# EAGLE design sensor (EAGLE 9.6.2)
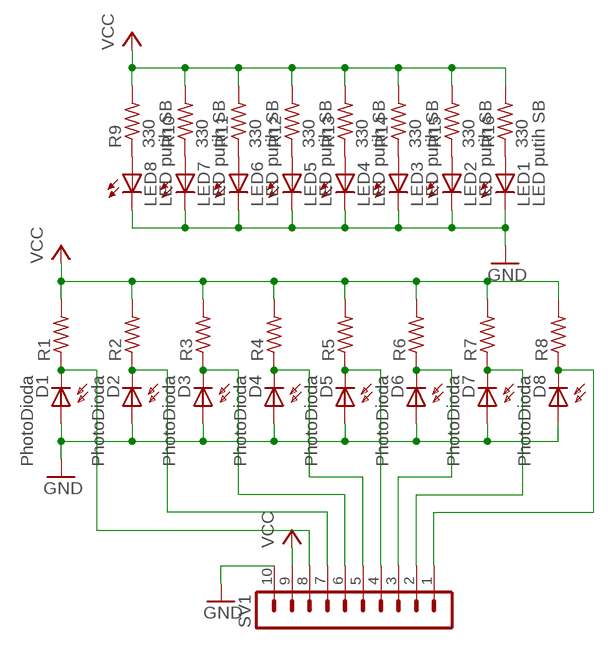
[diagram p0: schematic, sheet 1]

## Parts
D1  PhotoDioda  SFH225  [SFH225]
D2  PhotoDioda  SFH225  [SFH225]
D3  PhotoDioda  SFH225  [SFH225]
D4  PhotoDioda  SFH225  [SFH225]
D5  PhotoDioda  SFH225  [SFH225]
D6  PhotoDioda  SFH225  [SFH225]
D7  PhotoDioda  SFH225  [SFH225]
D8  PhotoDioda  SFH225  [SFH225]
LED1  LED putih SB  LED5MM  [LED5MM]
LED2  LED putih SB  LED5MM  [LED5MM]
LED3  LED putih SB  LED5MM  [LED5MM]
LED4  LED putih SB  LED5MM  [LED5MM]
LED5  LED putih SB  LED5MM  [LED5MM]
LED6  LED putih SB  LED5MM  [LED5MM]
LED7  LED putih SB  LED5MM  [LED5MM]
LED8  LED putih SB  LED5MM  [LED5MM]
R1  R-US_0207/10  [0207/10]
R2  R-US_0207/10  [0207/10]
R3  R-US_0207/10  [0207/10]
R4  R-US_0207/10  [0207/10]
R5  R-US_0207/10  [0207/10]
R6  R-US_0207/10  [0207/10]
R7  R-US_0207/10  [0207/10]
R8  R-US_0207/10  [0207/10]
R9  330  R-US_0207/10  [0207/10]
R10  330  R-US_0207/10  [0207/10]
R11  330  R-US_0207/10  [0207/10]
R12  330  R-US_0207/10  [0207/10]
R13  330  R-US_0207/10  [0207/10]
R14  330  R-US_0207/10  [0207/10]
R15  330  R-US_0207/10  [0207/10]
R16  330  R-US_0207/10  [0207/10]
SV1  MA10-1  [MA10-1]

## Nets
GND: D1.A D2.A D3.A D4.A D5.A D6.A D7.A D8.A LED1.K(C) LED2.K(C) LED3.K(C) LED4.K(C) LED5.K(C) LED6.K(C) LED7.K(C) LED8.K(C) SV1.10
N$1: LED7.A R10.1
N$2: D7.K(C) R7.1 SV1.2
N$3: D8.K(C) R8.1 SV1.1
N$4: D1.K(C) R1.1 SV1.8
N$5: D2.K(C) R2.1 SV1.7
N$6: D3.K(C) R3.1 SV1.6
N$7: D5.K(C) R5.1 SV1.4
N$8: D4.K(C) R4.1 SV1.5
N$9: D6.K(C) R6.1 SV1.3
N$10: LED6.A R11.1
N$11: LED5.A R12.1
N$12: LED4.A R13.1
N$13: LED3.A R14.1
N$14: LED2.A R15.1
N$15: LED1.A R16.1
N$16: LED8.A R9.1
VCC: R1.2 R2.2 R3.2 R4.2 R5.2 R6.2 R7.2 R8.2 R9.2 R10.2 R11.2 R12.2 R13.2 R14.2 R15.2 R16.2 SV1.9

## Library data of the parts
D1-D8 = opto-trans-siemens:SFH225: PHOTO DIODE
LED1-LED8 = led:LED: LED OSRAM: - CHIPLED LG R971, LG N971, LY N971, LG Q971, LY Q971, LO R971, LY R971 LH N974, LH R974 LS Q976, LO Q976, LY Q976 LO Q996 - Hyper CHIPLED LW Q18S LB Q993, LB Q99A, LB R99A - SideLED LS A670, LO A670, LY A670, LG A670, LP A670 LB A673, LV A673, LT A673, LW A673 LH A674 LY A675 LS A676, LA A676, LO A676, LY A676, LW A676 LS A679, LY A679, LG A679 - Hyper Micro SIDELED® LS Y876, LA Y876, LO Y876, LY Y876 LT Y87S - SmartLED LW L88C, LW L88S LB L89C, LB L89S, LG L890 LS L89K, LO L89K, LY L89K LS L896, LA L896, LO L896, LY L896 - TOPLED LS T670, LO T670, LY T670, LG T670, LP T670 LSG T670, LSP T670, LSY T670, LOP T670, LYG T670 LG T671, LOG T671, LSG T671 LB T673, LV T673, LT T673, LW T673 LH T674 LS T676, LA T676, LO T676, LY T676, LB T676, LH T676, LSB T676, LW T676 LB T67C, LV T67C, LT T67C, LS T67K, LO T67K, LY T67K, LW E67C LS E67B, LA E67B, LO E67B, LY E67B, LB E67C, LV E67C, LT E67C LW T67C LS T679, LY T679, LG T679 LS T770, LO T770, LY T770, LG T770, LP T770 LB T773, LV T773, LT T773, LW T773 LH T774 LS E675, LA E675, LY E675, LS T675 LS T776, LA T776, LO T776, LY T776, LB T776 LHGB T686 LT T68C, LB T68C - Hyper Mini TOPLED® LB M676 - Mini TOPLED Santana® LG M470 LS M47K, LO M47K, LY M47K Source: http://www.osram.convergy.de LUXEON: - LUMILED® LXK2-PW12-R00, LXK2-PW12-S00, LXK2-PW14-U00, LXK2-PW14-V00 LXK2-PM12-R00, LXK2-PM12-S00, LXK2-PM14-U00 LXK2-PE12-Q00, LXK2-PE12-R00, LXK2-PE12-S00, LXK2-PE14-T00, LXK2-PE14-U00 LXK2-PB12-K00, LXK2-PB12-L00, LXK2-PB12-M00, LXK2-PB14-N00, LXK2-PB14-P00, LXK2-PB14-Q00 LXK2-PR12-L00, LXK2-PR12-M00, LXK2-PR14-Q00, LXK2-PR14-R00 LXK2-PD12-Q00, LXK2-PD12-R00, LXK2-PD12-S00 LXK2-PH12-R00, LXK2-PH12-S00 LXK2-PL12-P00, LXK2-PL12-Q00, LXK2-PL12-R00 Source: www.luxeon.com KINGBRIGHT: KA-3528ASYC Source: www.kingbright.com
R1-R16 = resistor:R-US_: RESISTOR, American symbol
SV1 = con-lstb:MA10-1: PIN HEADER

## Board
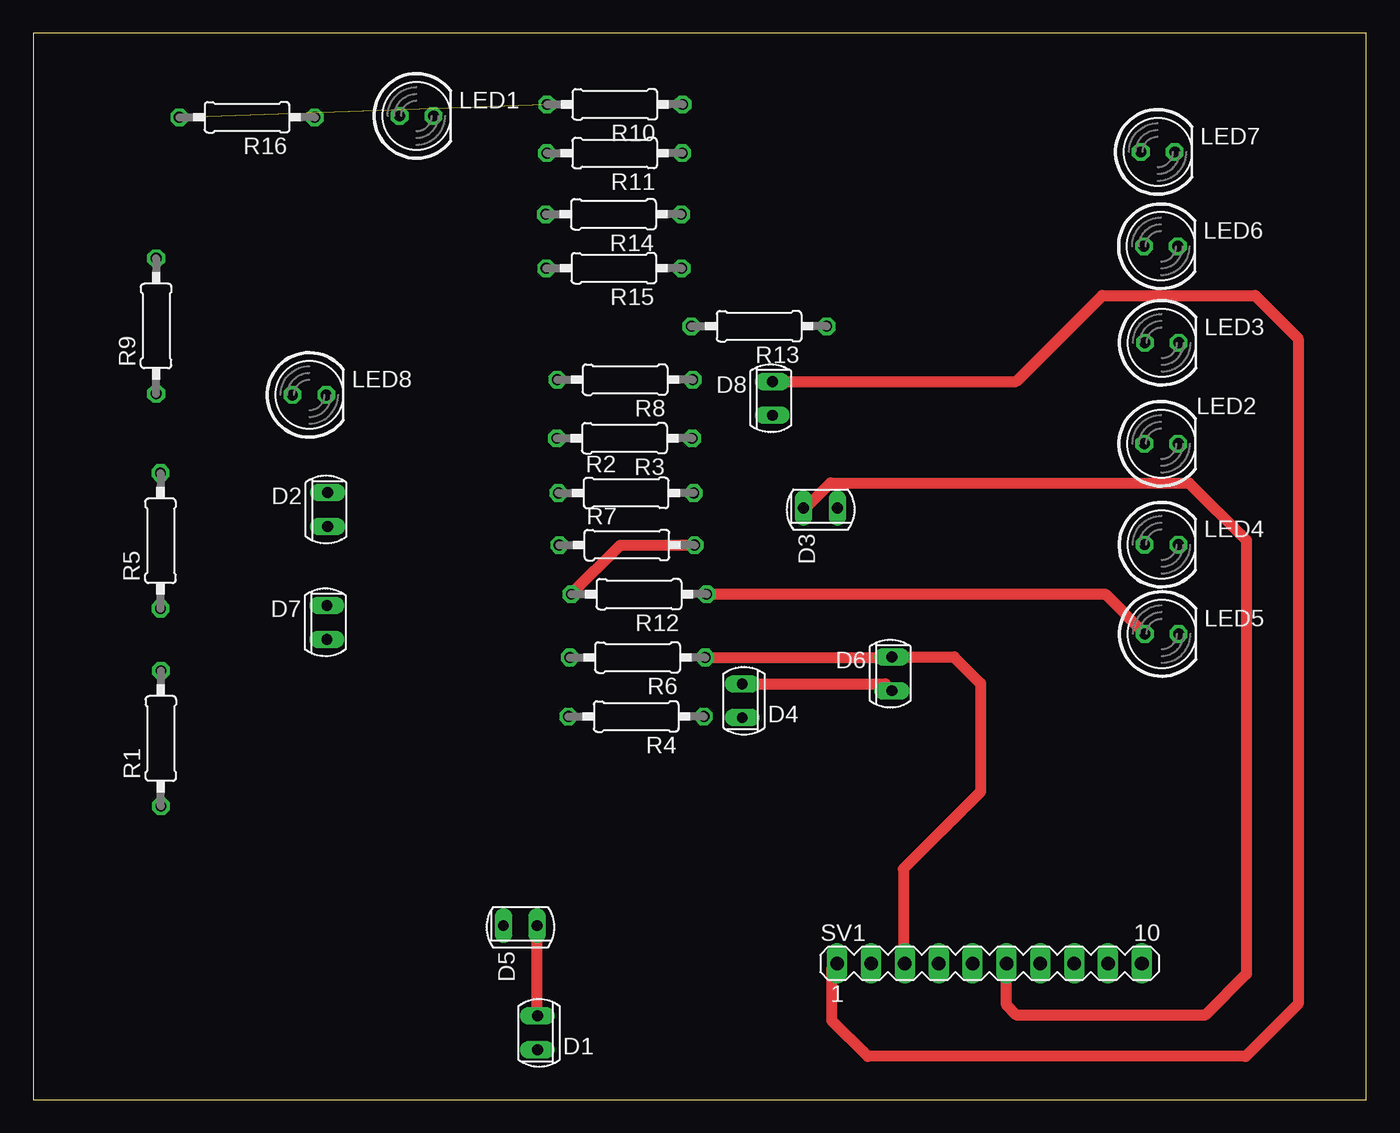
[diagram p1: board, top side]
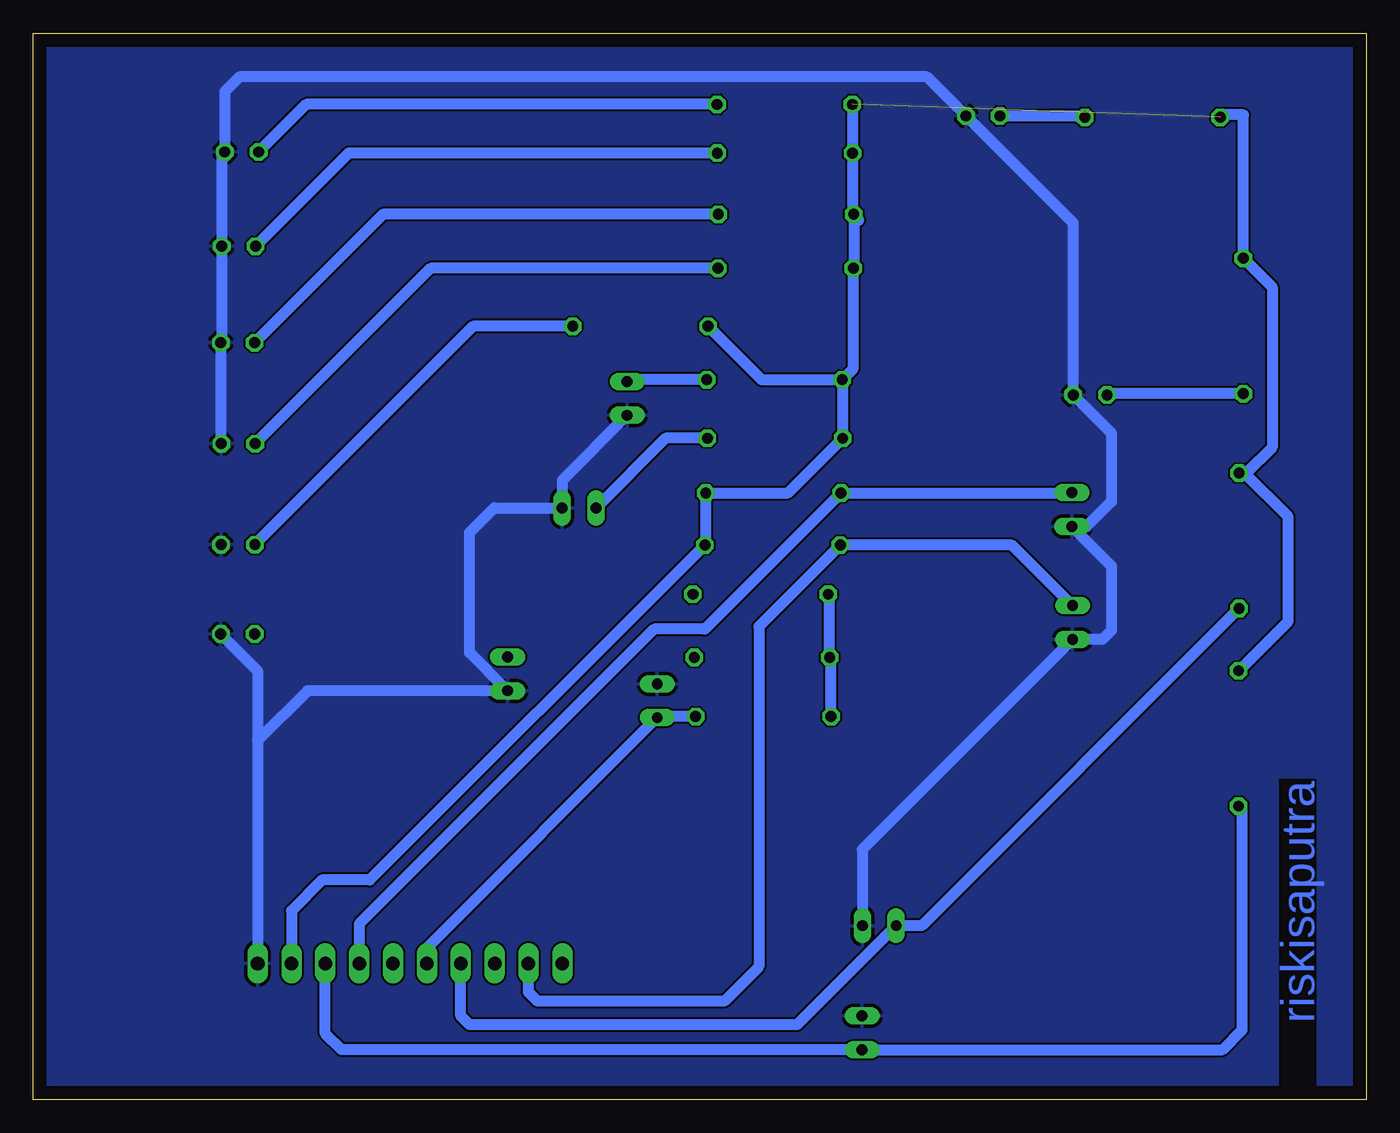
[diagram p2: board, bottom side, seen from below]

Size 100 x 80 mm. Coordinates in mm from the lower left corner, seen from the top.
Outline: 0,0 100,0 100,80 0,80 0,0
Copper layers (1*16): Top 0.035mm / dielectric 1.5mm / Bottom 0.035mm
Design rules "default": minimum track width 6mil, minimum drill 0.35mm, track to track 6mil, track to pad 6mil, pad to pad 6mil, via to via 6mil, smd to smd 6mil, copper to edge 40mil, drill to drill 6mil, minimum pad ring 10mil, minimum via ring 8mil, stop-mask expansion 4mil, vias tented up to drill 0mil, thermal gap 10mil

### Footprints (pad centres in the part's own frame; a part is rotated, then mirrored left to right if it is on the bottom)
SFH225 = drill 0.813 long: A 0,1.27; K 0,-1.27
LED5MM = drill 0.813 octagon: A -1.27,0; K 1.27,0
0207/10 = drill 0.813 octagon: 1 -5.08,0; 2 5.08,0
MA10-1 = drill 1.016 long: 1 -11.43,0; 2 -8.89,0; 3 -6.35,0; 4 -3.81,0; 5 -1.27,0; 6 1.27,0; 7 3.81,0; 8 6.35,0; 9 8.89,0; 10 11.43,0

### Placement (x,y rotation side)
D1  37.82,5.01 0 top
D2  22.08,44.26 180 top
D3  59.06,44.38 270 top
D4  53.19,29.92 0 top
D5  36.53,13.05 270 top
D6  64.41,31.94 180 top
D7  22.03,35.79 180 top
D8  55.45,52.61 180 top
LED1  28.75,73.8 0 top
LED2  84.62,49.21 0 top
LED3  84.67,56.78 0 top
LED4  84.65,41.63 0 top
LED5  84.66,34.93 0 top
LED6  84.6,64.02 0 top
LED7  84.36,71.1 0 top
LED8  20.71,52.87 0 top
R1  9.57,27.09 90 top
R2  44.48,45.51 0 top
R3  44.35,49.62 180 top
R4  45.23,28.74 180 top
R5  9.54,41.92 90 top
R6  45.33,33.17 180 top
R7  44.53,41.6 0 top
R8  44.39,54.01 180 top
R9  9.22,58.04 90 top
R10  43.63,74.67 180 top
R11  43.61,71.01 180 top
R12  45.44,37.91 180 top
R13  54.45,58.02 180 top
R14  43.53,66.42 180 top
R15  43.56,62.37 180 top
R16  16.03,73.7 180 top
SV1  71.74,10.21 0 top

### Tracks (layer width: path | path; a pad name or v marks a point on that pad's centre or on a via)
GND
  Top 0.813: D1.A 37.8,6.3 D5.A | D4.A 63.9,31.19 D6.A
  Bottom 0.813: 85.89,56.83 LED3.K | LED2.K 85.89,56.83 | 85.89,56.83 85.87,56.85 LED6.K 85.87,70.87 LED7.K 85.63,75.64 84.53,76.74 32.96,76.74 LED1.K 21.98,65.76 LED8.K 19.1,49.99 19.1,44.87 20.98,42.99 D2.A 19.11,40.02 19.11,35.21 19.79,34.52 D7.A 37.8,18.75 D5.A | LED5.K 83.17,32.17 83.17,26.94 | 83.17,26.94 SV1.10 | 83.17,26.94 79.44,30.67 D6.A 67.27,33.53 67.27,42.54 65.42,44.38 D3.A 60.33,46.46 D8.A
  pour Bottom: 0.22,79.87 99.88,79.87 100.01,79.73 100.01,0.64 99.5,0.12 0.41,0.12 0.18,0.36 0.18,79.97 0.2,79.99
N$1
  Bottom 0.813: R10.1 79.53,74.67 LED7.A
N$2
  Bottom 0.813: D7.K 26.57,41.6 R7.1 45.56,35.49 45.56,9.97 48.16,7.37 62.17,7.37 62.85,8.05 SV1.2
N$3
  Top 0.813: D8.K 73.74,53.88 80.19,60.33 91.67,60.33 94.9,57.09 94.9,7.18 90.95,3.23 62.61,3.23 59.92,5.92 59.92,9.82 SV1.1
  Bottom 0.813: R8.1 55.32,54.01 D8.K
N$4
  Bottom 0.813: R1.1 9.3,21.74 9.3,5.21 10.78,3.74 D1.K 76.89,3.74 78.09,4.94 SV1.8
N$5
  Bottom 0.813: D2.K 21.96,45.41 21.57,45.41 21.67,45.51 R2.1 49.61,35.3 53.42,35.3 75.55,13.17 SV1.7
N$6
  Top 0.813: D3.K 57.94,44.38 59.82,46.26 86.71,46.26 91.01,41.96 91.01,9.43 87.92,6.34 73.76,6.34 73.01,7.09 SV1.6
  Bottom 0.813: R3.1 52.55,49.62 D3.K
N$7
  Bottom 0.813: R5.1 33.34,13.05 D5.K 42.7,5.61 67.27,5.61 67.93,6.27 SV1.4
N$8
  Bottom 0.813: R4.1 53.11,28.74 D4.K 70.47,11.38 SV1.5
N$9
  Top 0.813: R6.1 64.37,33.17 D6.K 69.07,33.21 71.06,31.22 71.06,23.09 65.27,17.3 65.27,10.33 SV1.3
N$10
  Bottom 0.813: R11.1 76.34,71.01 LED6.A
N$11
  Top 0.813: R12.1 80.41,37.91 LED5.A
N$12
  Bottom 0.813: R13.1 66.99,58.02 LED4.A
N$13
  Bottom 0.813: R14.1 73.76,66.42 LED3.A
N$14
  Bottom 0.813: R15.1 70.19,62.37 LED2.A
N$15
  Bottom 0.813: LED1.A 21.22,73.8 R16.1
N$16
  Bottom 0.813: R9.1 19.35,52.96 LED8.A
VCC  (1 unrouted)
  Top 0.813: R12.2 44.05,41.6 R7.2
  Bottom 0.813: R16.2 10.77,73.88 9.22,73.88 R9.2 7.06,60.96 7.06,48.94 8.99,47 9.13,47 | R10.2 38.55,71.03 R11.2 38.53,66.42 38.07,65.96 38.07,65.98 38.48,66.39 R14.2 38.45,62.4 R15.2 | R15.2 38.47,62.36 | R15.2 38.57,62.28 | R13.2 45.36,54.01 R8.2 | R8.2 38.48,54.85 R15.2 | R8.2 39.27,53.97 R3.2 43.38,45.51 R2.2 49.55,41.66 R7.2 74.75,16.46 78.33,16.46 80.63,14.17 SV1.9 | R1.2 5.85,35.89 5.85,43.73 9.13,47 | 9.13,47 R5.2 | R12.2 40.25,37.8 R6.2 40.15,33.06 R4.2

### Text on the board
Bottom: riskisaputra